# Altium schematic sheet 光电插板1路.SCHDOC
size A4
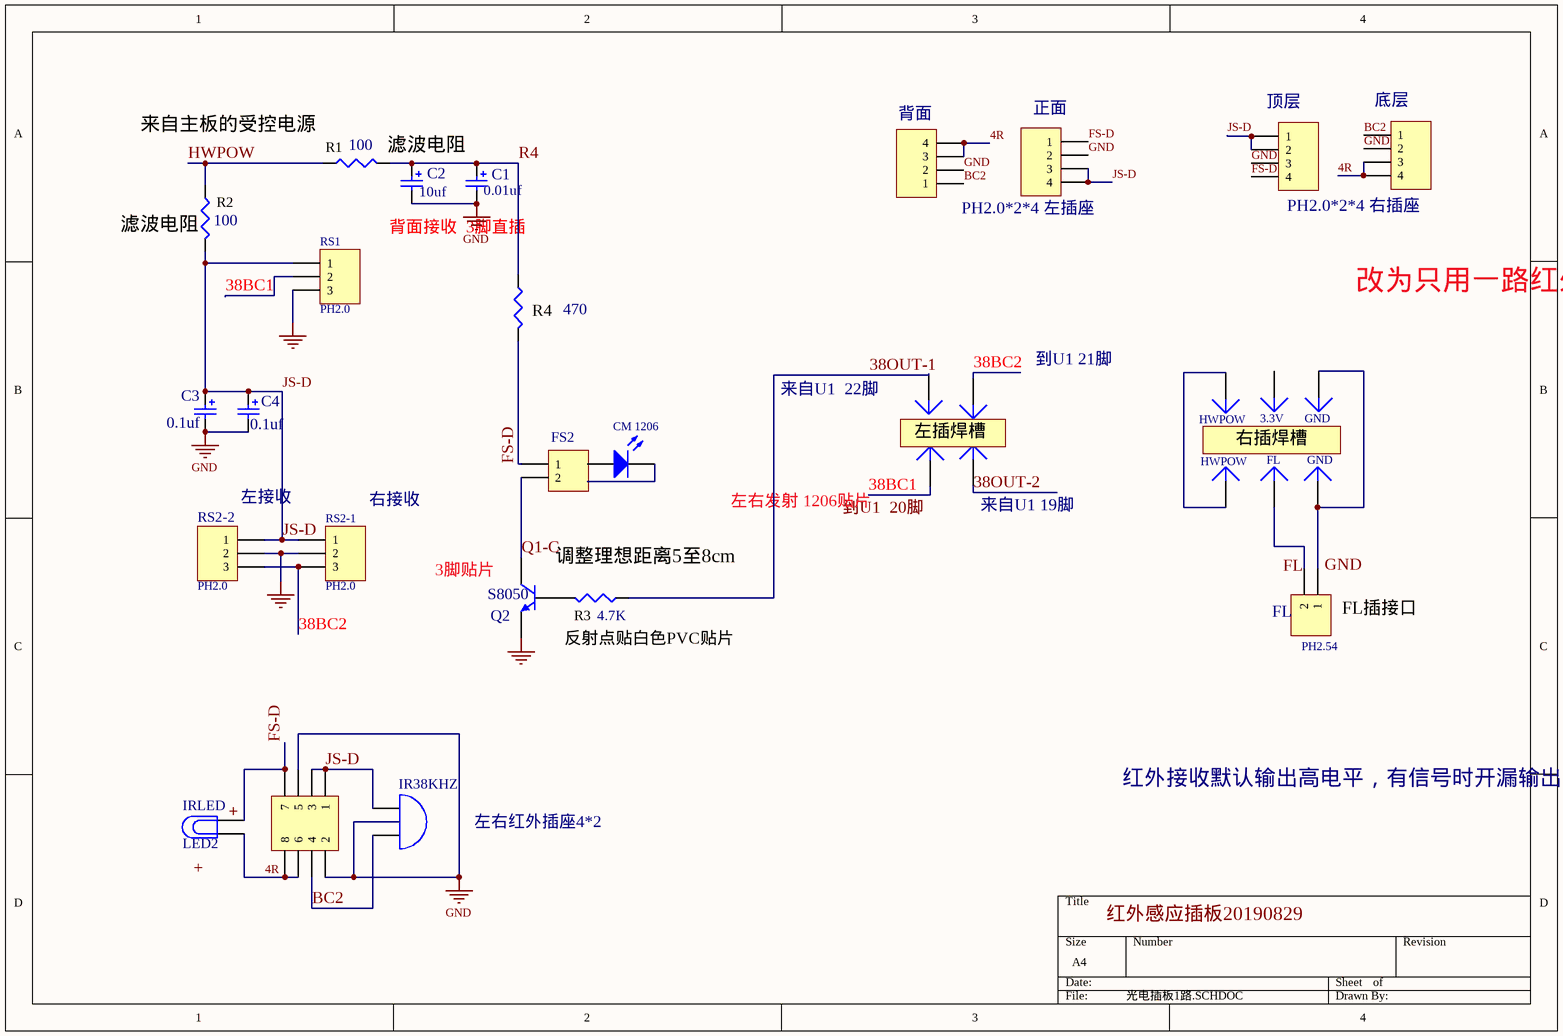
[diagram p0: 光电插板1路.SCHDOC]

## Parts
(Parts that share a designator on the sheet are numbered #1, #2 ... from top to bottom, then left to right.)
3.3V  (no value)  [PIN1]
38BC1  (no value)  [PIN1]
38OUT  (no value)  [PIN1]
?#1  (no value)  [PIN1]
?#2  GND  [PIN1]
C1  0.01uf  [CC2012-0805]
C2  value 10uf  [CC2012-0805]
C3  value 0.1uf  [CC2012-0805]
C4  value 0.1uf  [CC2012-0805]
CM_1206  (no value)  [LED-1]
FL#1  (no value)  [PIN1]
FL#2  PH2.54  [HDR1X2]
FS2  PH2.0  [HDR1X2]  (value not drawn)
GND  (no value)  [PIN1]
HWPOW#1  (no value)  [PIN1]
HWPOW#2  (no value)  [PIN1]
IR38KHZ  (no value)  [PIN2]
IRLED  LED2  [PIN2]
Q2  S8050  [BCY-W3/E4]
R1  100  [C1608-0603]
R2  100  [C1608-0603]
R3  value 4.7K  [C1608-0603]
R4  value 470  [C1608-0603]
RS1  PH2.0  [HDR1X3]
RS2-1  PH2.0  [HDR1X3]
RS2-2  PH2.0  [HDR1X3]
到U1_21脚  (no value)  [PIN1]
左右红外插座4*2  PH2.0*2*4  [HDR2X4H]  (value not drawn)
底层  PH2.0*2*4  [HDR1X4]  (value not drawn)
正面  PH2.0*2*4 左插座  [HDR1X4]
背面  PH2.0*2*4  [HDR1X4]  (value not drawn)
顶层  PH2.0*2*4 右插座  [HDR1X4]

## Nets
GND: C1.2 C2.2 C3.2 C4.2 Q2.1(E) RS1.3 RS2-1.2 RS2-2.2 左右红外插座4*2.2 左右红外插座4*2.5 底层.2 正面.2 背面.2 顶层.3
4R: IRLED.1 左右红外插座4*2.6 左右红外插座4*2.8 底层.3 底层.4 背面.3 背面.4
38BC1: 38OUT.1 RS1.2
38BC2: RS2-1.3 RS2-2.3 到U1_21脚.1
38OUT-1: ?#1.1 R3.2
38OUT-2: 38BC1.1
BC2: IR38KHZ.2(B) 左右红外插座4*2.4 底层.1 背面.1
FS-D: FS2.1 IRLED.2 R4.1 左右红外插座4*2.7 正面.1 顶层.4
HWPOW: R1.2 R2.2
JS-D: C3.1 C4.1 IR38KHZ.1(A) R2.1 RS1.1 RS2-1.1 RS2-2.1 左右红外插座4*2.1 左右红外插座4*2.3 正面.3 正面.4 顶层.1 顶层.2
Q1-C: FS2.2 Q2.3(C)
R4: C1.1 C2.1 R1.1 R4.2
Net?#2_1: ?#2.1 FL#2.2
NetFL#1_1: FL#1.1 FL#2.1 GND.1
NetHWPOW#1_1: HWPOW#1.1 HWPOW#2.1
NetQ2_2: Q2.2(B) R3.1

Not connected (* = marked no-connect by the designer): 3.3V 1; CM_1206 1(A) 2(K)

## Notes on the sheet
- 背面接收  3脚直插
- 改为只用一路红外（BC1），另一路（BC2）用干簧管。
- (near RS2-2) 左接收
- (near RS2-1) 右接收
- (near CM_1206) 左右发射 1206贴片
- 3脚贴片
- 红外接收默认输出高电平，有信号时开漏输出
- Labels drawn without touching a wire or pin: +, FL, FL插接口, GND, 到U1  20脚, 反射点贴白色PVC贴片, 右插焊槽, 左插焊槽, 来自U1 19脚, 来自U1  22脚, 来自主板的受控电源, 滤波电阻, 红外感应插板20190829, 调整理想距离5至8cm

## Library data of the parts
3.3V 38BC1 38OUT ?#1 ?#2 FL#1 GND HWPOW#1 HWPOW#2 到U1_21脚 = Plug: LatestRevisionDate: 17-Jul-2002; LatestRevisionNote: Re-released for DXP Platform.; Publisher: Altium Limited
C1 = Cap Pol3: Polarized Capacitor (Surface Mount); C2: 0.1uf; Published: 8-Jun-2000; LatestRevisionDate: 17-Jul-2002; LatestRevisionNote: Re-released for DXP Platform.; Publisher: Altium Limited; PackageReference: C0805
C2-C4 = Cap Pol3: Polarized Capacitor (Surface Mount); Published: 8-Jun-2000; LatestRevisionDate: 17-Jul-2002; LatestRevisionNote: Re-released for DXP Platform.; Publisher: Altium Limited; PackageReference: C0805
CM_1206 = LED1: Typical RED GaAs LED; Published: 8-Jun-2000; LatestRevisionDate: 17-Jul-2002; LatestRevisionNote: Re-released for DXP Platform.; Publisher: Altium Limited
FL#2 FS2 = Header 2: Header, 2-Pin; LatestRevisionDate: 17-Jul-2002; LatestRevisionNote: Re-released for DXP Platform.; Publisher: Altium Limited
IR38KHZ = Bell: Electrical Bell; Published: 24-Mar-1999; LatestRevisionDate: 17-Jul-2002; LatestRevisionNote: Re-released for DXP Platform.; Publisher: Altium Limited
IRLED = Lamp: Incandescent Bulb; Published: 24-Mar-1999; LatestRevisionDate: 17-Jul-2002; LatestRevisionNote: Re-released for DXP Platform.; Publisher: Altium Limited
Q2 = 2N3904: NPN General Purpose Amplifier; Published: 8-Jun-2000; LatestRevisionDate: 15-Jan-2003; LatestRevisionNote: PCB Footprint 'BCY-W3/D4.7' replaced; DatasheetDocument: 1997; PackageReference: TO-92A; Publisher: Altium Limited; Code_JEDEC: TO-92A
R1-R4 = Res3: Resistor; Published: 8-Jun-2000; LatestRevisionDate: 17-Jul-2002; LatestRevisionNote: Re-released for DXP Platform.
  R1 R2: 100: 100
  R3 R4: Publisher: Altium Limited
RS1 RS2-1 RS2-2 = Header 3: Header, 3-Pin; LatestRevisionDate: 17-Jul-2002; LatestRevisionNote: Re-released for DXP Platform.; Publisher: Altium Limited
左右红外插座4*2 = Header 4X2H: Header, 4-Pin, Dual row, Right Angle; LatestRevisionDate: 17-Jul-2002; LatestRevisionNote: Re-released for DXP Platform.; Publisher: Altium Limited
底层 正面 背面 顶层 = Header 4: Header, 4-Pin; LatestRevisionDate: 17-Jul-2002; LatestRevisionNote: Re-released for DXP Platform.; Publisher: Altium Limited